# Altium schematic sheet pca20035_sheet5_power_supply.SchDoc: Thingy:91 Power Supply
size A3; Organization: Nordic Semiconductor; DocumentNumber: 5; SheetNumber: 5; SheetTotal: 6; CompanyName: Nordic Semiconductor; DocumentSize: A3
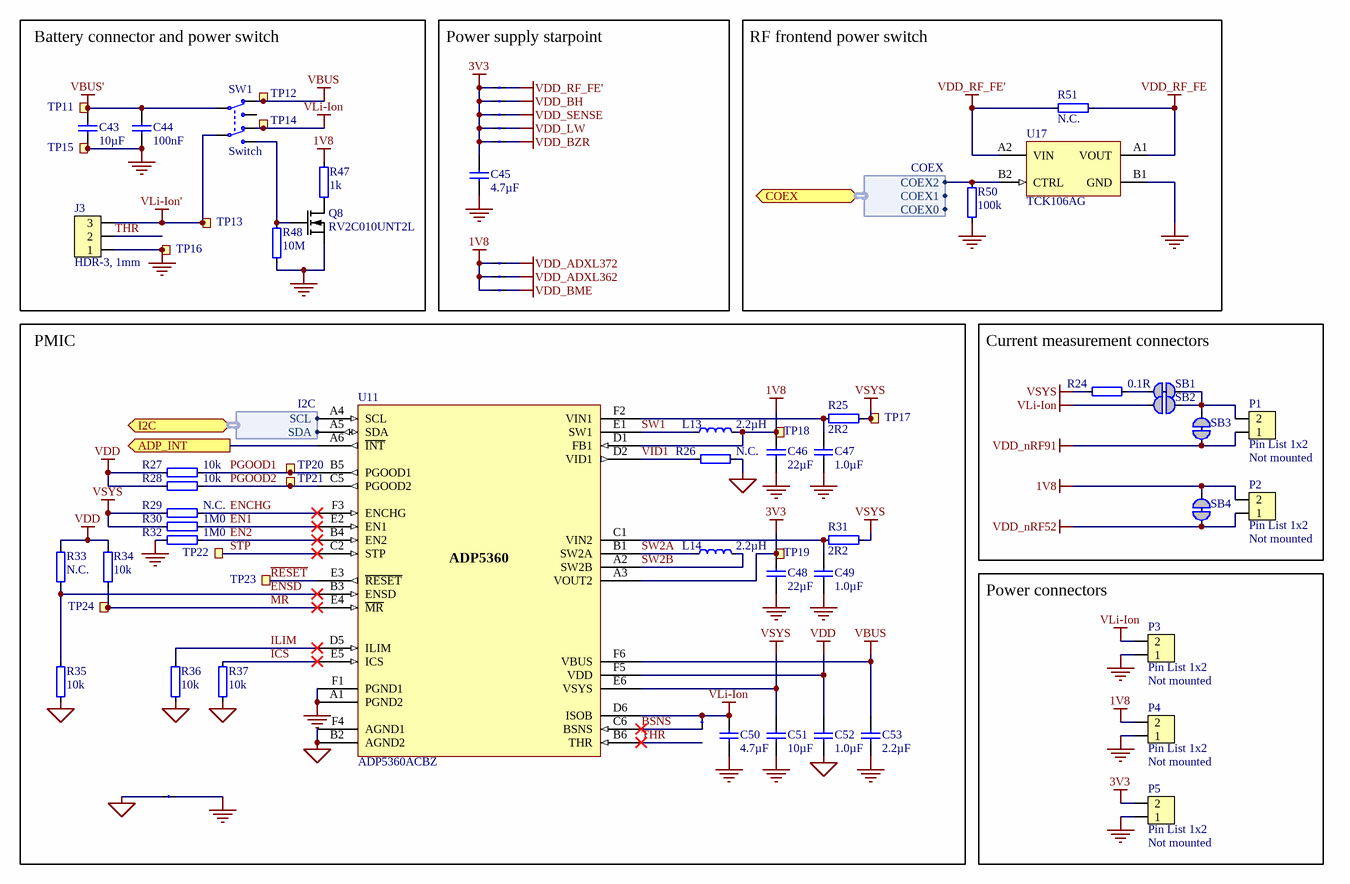
[diagram p0: pca20035_sheet5_power_supply.SchDoc]

## Parts
C43  10µF  [CAPC1608X06L]
C44  100nF  [CAPC0603X03L_C]
C45  4.7µF  [CAPC1608X06L]
C46  22µF  [CAPC1608X06L]
C47  1.0µF  [CAPC1005X04L]
C48  22µF  [CAPC1608X06L]
C49  1.0µF  [CAPC1608X06L]
C50  4.7µF  [CAPC1608X06L]
C51  10µF  [CAPC1608X06L]
C52  1.0µF  [CAPC1005X04L]
C53  2.2µF  [CAPC1608X06L]
J3  HDR-3, 1mm  [SM03B-SRSS-TB]
L13  2.2µH  [INDC2016X18N]
L14  2.2µH  [INDC2016X18N]
P1  Pin List 1x2  Assembly: Not mounted  [LIST_1x2-NC]
P2  Pin List 1x2  Assembly: Not mounted  [LIST_1x2-NC]
P3  Pin List 1x2  Assembly: Not mounted  [LIST_1x2-NC]
P4  Pin List 1x2  Assembly: Not mounted  [LIST_1x2-NC]
P5  Pin List 1x2  Assembly: Not mounted  [LIST_1x2-NC]
Q8  RV2C010UNT2L  [DFN65P100X40-3L]
R24  0.1R  [RESC1005X04L]
R25  2R2  [RESC1005X04L]
R26  N.C.  [RESC0603X03L_C_NC]
R27  10k  [RESC0603X03L_C]
R28  10k  [RESC0603X03L_C]
R29  N.C.  [RESC0603X03L_C_NC]
R30  1M0  [RESC0603X03L_C]
R31  2R2  [RESC1005X04L]
R32  1M0  [RESC0603X03L_C]
R33  N.C.  [RESC0603X03L_C_NC]
R34  10k  [RESC0603X03L_C]
R35  10k  [RESC0603X03L_C]
R36  10k  [RESC0603X03L_C]
R37  10k  [RESC0603X03L_C]
R47  1k  [RESC0603X03L_C]
R48  10M  [RESC0603X03L_C]
R50  100k  [RESC0603X03L_C]
R51  N.C.  [RESC0603X03L_C_NC]
SB1  Solderbridge  [Solderbridge_Shorted]  (value not drawn)  (net tie, no BOM)
SB2  Solderbridge  [Solderbridge]  (value not drawn)  (no BOM)
SB3  Solderbridge  [Solderbridge_Shorted]  (value not drawn)  (net tie, no BOM)
SB4  Solderbridge  [Solderbridge_Shorted]  (value not drawn)  (net tie, no BOM)
ST1  N.A.  [2 PIN STARPOINT]  (value not drawn)  (net tie, no BOM)
ST2  N.A.  [2 PIN STARPOINT]  (value not drawn)  (net tie, no BOM)
ST3  N.A.  [2 PIN STARPOINT]  (value not drawn)  (net tie, no BOM)
ST4  N.A.  [2 PIN STARPOINT]  (value not drawn)  (net tie, no BOM)
ST5  N.A.  [2 PIN STARPOINT]  (value not drawn)  (net tie, no BOM)
ST7  N.A.  [2 PIN STARPOINT]  (value not drawn)  (net tie, no BOM)
ST8  N.A.  [2 PIN STARPOINT]  (value not drawn)  (net tie, no BOM)
ST9  N.A.  [2 PIN STARPOINT]  (value not drawn)  (net tie, no BOM)
ST10  N.A.  [2 PIN STARPOINT]  (value not drawn)  (net tie, no BOM)
ST11  N.A.  [2 PIN STARPOINT]  (value not drawn)  (net tie, no BOM)
SW1  Switch  [Switch-Slide-RA-J-Lead-DPDT-8.5x3.5mm]
TP11  Ø1.5mm,SMD  [TP_SMD_Ø1.5mm]  (value not drawn)  (no BOM)
TP12  Ø1.5mm,SMD  [TP_SMD_Ø1.5mm]  (value not drawn)  (no BOM)
TP13  Ø1.5mm,SMD  [TP_SMD_Ø1.5mm]  (value not drawn)  (no BOM)
TP14  Ø1.5mm,SMD  [TP_SMD_Ø1.5mm]  (value not drawn)  (no BOM)
TP15  Ø1.5mm,SMD  [TP_SMD_Ø1.5mm]  (value not drawn)  (no BOM)
TP16  Ø1.5mm,SMD  [TP_SMD_Ø1.5mm]  (value not drawn)  (no BOM)
TP17  Ø1.5mm,SMD  [TP_SMD_Ø1.5mm]  (value not drawn)  (no BOM)
TP18  Ø1.5mm,SMD  [TP_SMD_Ø1.5mm]  (value not drawn)  (no BOM)
TP19  Ø1.5mm,SMD  [TP_SMD_Ø1.5mm]  (value not drawn)  (no BOM)
TP20  Ø1.5mm,SMD  [TP_SMD_Ø1.5mm]  (value not drawn)  (no BOM)
TP21  Ø1.5mm,SMD  [TP_SMD_Ø1.5mm]  (value not drawn)  (no BOM)
TP22  Ø1.0mm,SMD  [TP_SMD_Ø1.0mm]  (value not drawn)  (no BOM)
TP23  Ø1.0mm,SMD  [TP_SMD_Ø1.0mm]  (value not drawn)  (no BOM)
TP24  Ø1.0mm,SMD  [TP_SMD_Ø1.0mm]  (value not drawn)  (no BOM)
U11  ADP5360ACBZ  [BGA32C40P6X6_238X238X56]
U17  TCK106AG  [BGA4C40P2X2_76X76X62]

## Blocks framed on the sheet
Battery connector and power switch: C43 C44 J3 Q8 R47 R48 SW1 TP11-TP16
Power supply starpoint: C45 ST1-ST5 ST7-ST9
RF frontend power switch: R50 R51 U17
PMIC: C46-C53 L13 L14 R25-R37 ST10 ST11 TP17-TP24 U11
Current measurement connectors: P1 P2 R24 SB1-SB4
Power connectors: P3-P5

## Ports
ADP_INT (out), COEX (bidir, harness COEX), I2C (bidir, harness I2C)

## Harnesses
I2C: SDA, SCL
COEX: COEX2, COEX1, COEX0

## Nets
1V8: C46.2 L13.2 P2.2 P4.2 R47.1 SB4.2 ST7.1 ST8.1 ST9.1 TP18.1 U11.D1(FB1)
3V3: C45.2 C48.2 P5.2 ST1.1 ST2.1 ST3.1 ST4.1 ST5.1 TP19.1 U11.A3(VOUT2)
AGND: C52.1 R26.2 R35.1 R36.2 R37.2 ST11.1 U11.B2(AGND2) U11.F4(AGND1)
GND: C43.2 C44.2 C45.1 C46.1 C47.1 C48.1 C49.1 C50.1 C51.1 C53.1 J3.1 P3.1 P4.1 P5.1 Q8.2(S) R32.1 R48.2 R50.1 ST11.2 TP15.1 TP16.1 U11.A1(PGND2) U11.F1(PGND1) U17.B1(GND)
VBUS: C53.2 SW1.3(N.C-1) TP12.1 U11.F6(VBUS)
VBUS': C43.1 C44.1 SW1.2(COM-1) TP11.1
VDD: C52.2 R27.1 R28.1 R33.2 R34.1 U11.F5(VDD)
VDD_ADXL362: ST8.2
VDD_ADXL372: ST7.2
VDD_BH: ST2.2
VDD_BME: ST9.2
VDD_BZR: ST5.2
VDD_LW: ST4.2
VDD_nRF52: P2.1 SB4.1
VDD_nRF91: P1.1 SB3.1
VDD_RF_FE: R51.1 U17.A1(VOUT)
VDD_RF_FE': R51.2 ST1.2 U17.A2(VIN)
VDD_SENSE: ST3.2
VLi-Ion: C50.2 P3.2 SB2.2 ST10.2 SW1.6(N.C-2) TP14.1 U11.D6(ISOB)
VLi-Ion': J3.3 SW1.5(COM-2) TP13.1
VSYS: C51.2 R24.2 R25.2 R29.1 R30.1 R31.2 TP17.1 U11.E6(VSYS)
ADP_INT: U11.A6(~{INT}) ; port ADP_INT
BSNS: ST10.1 U11.C6(BSNS)
EN1: R30.2 U11.E2(EN1)
EN2: R32.2 U11.B4(EN2)
ENCHG: R29.2 U11.F3(ENCHG)
ENSD: R33.1 R35.2 U11.B3(ENSD)
ICS: R37.1 U11.E5(ICS)
ILIM: R36.1 U11.D5(ILIM)
~{MR}: R34.2 TP24.1 U11.E4(~{MR})
PGOOD1: R27.2 TP20.1 U11.B5(PGOOD1)
PGOOD2: R28.2 TP21.1 U11.C5(PGOOD2)
~{RESET}: TP23.1 U11.E3(~{RESET})
STP: TP22.1 U11.C2(STP)
SW1: L13.1 U11.E1(SW1)
SW2A: L14.1 U11.B1(SW2A)
SW2B: L14.2 U11.A2(SW2B)
THR: J3.2 U11.B6(THR)
VID1: R26.1 U11.D2(VID1)
NetC47_2: C47.2 R25.1 U11.F2(VIN1)
NetC49_2: C49.2 R31.1 U11.C1(VIN2)
NetP1_2: P1.2 SB1.1 SB2.1 SB3.2
NetQ8_1: Q8.1(G) R48.1 SW1.4(N.O-2)
NetQ8_3: Q8.3(D) R47.2
NetR24_1: R24.1 SB1.2
NetR50_2: R50.2 U17.B2(CTRL) ; port COEX.COEX2
NetU11_A4: U11.A4(SCL) ; port I2C.SCL
NetU11_A5: U11.A5(SDA) ; port I2C.SDA

Not connected (* = marked no-connect by the designer): SW1 1(N.O-1)

## Notes on the sheet
- Size
- Date:
- A3
- Project Number
- Sheet         of
- Revision
- File:
- Drawn By:
- (in symbol ADP5360ACBZ) ADP5360

## Library data of the parts
C43 C51 = C0603-10µ: Capacitor, X5R, ±20%; Manufacturer: N.A.; Part number IPS: 00000007785; Note: 6.3V; Artikkelnr Noca: 20039234; Pad Count: 2; Part Number: C0603-10µ; Manufacturer Part Number: N.A.; LatestRevisionDate: 2011-01-17; Published: 2011-01-17; Value: 10µF; Footprint Doc: 0603; ComponentLink1URL: N.A.; ComponentLink1Description: Datasheet; ComponentLink2URL: N.A.; ComponentLink2Description: Supplier link; HelpURL: N.A.; Supplier 1: N.A.; Supplier Part Number 1: N.A.; Supplier 2: N.A.; Supplier Part Number 2: N.A.; Component Class: Capacitors; PartId: 100200275
C44 = C0201-100n: Capacitor, X5R, ±10%; Manufacturer: N.A.; Part number IPS: 00000001248, 00000002505; Note: 16V; Pad Count: 2; Part Number: C0201-100n; Manufacturer Part Number: N.A.; LatestRevisionDate: 2017-11-09; Published: 2014-11-13; Value: 100nF; Artikkelnr Noca: N.A.; Footprint Doc: 0201; ComponentLink1URL: N.A.; ComponentLink1Description: Datasheet; ComponentLink2URL: N.A.; ComponentLink2Description: Supplier link; HelpURL: N.A.; Supplier 1: N.A.; Supplier Part Number 1: N.A.; Supplier 2: N.A.; Supplier Part Number 2: N.A.; Component Class: Capacitors; PartId: 100200078
C45 C50 = C0603-4µ7: Capacitor, X5R, ±10%; Manufacturer: N.A.; Part number IPS: 00000007783; Note: 6.3V; Artikkelnr Noca: 20069060; Pad Count: 2; Part Number: C0603-4µ7; Manufacturer Part Number: N.A.; Footprint Doc: 0603; LatestRevisionDate: 2009-11-23; Published: 2009-05-08; Value: 4.7µF; ComponentLink1URL: N.A.; ComponentLink1Description: Datasheet; ComponentLink2URL: N.A.; ComponentLink2Description: Supplier link; HelpURL: N.A.; Supplier 1: N.A.; Supplier Part Number 1: N.A.; Supplier 2: N.A.; Supplier Part Number 2: N.A.; Component Class: Capacitors; PartId: 100200274
C46 C48 = C0603-22µ-6.3V: Capacitor, X5R, ±20%, 6.3V; Manufacturer: Samsung Electro-Mechanics America; Manufacturer Part Number: CL10A226MQ8NRNC; Part number IPS: 00000007787; Artikkelnr Noca: N.A.; Pad Count: 2; Part Number: C0603-22µ-6.3V; Footprint Doc: 0603; LatestRevisionDate: 2015-04-10; Published: 2015-04-10; Value: 22µF; Note: 6.3V; ComponentLink1URL: N.A.; ComponentLink1Description: Datasheet; ComponentLink2URL: N.A.; ComponentLink2Description: Supplier link; HelpURL: http://www.samsungsem.com/kr/front/downloadcms.do?path=/kr/support/product-search/mlcc/__icsFiles/afieldfile/2014/11/05&fileName=S_CL10A226MQ8NRNC.pdf; Supplier 1: Digi-Key; Supplier Part Number 1: 1276-1193-1-ND; Supplier 2: N.A.; Supplier Part Number 2: N.A.; Component Class: Capacitors; PartId: 100200363
C47 C52 = C0402-1µ0: Capacitor, X5R, ±5%, 6.3V; Manufacturer: N.A.; Part number IPS: 00000007786, 00000003457; Artikkelnr Noca: 20039235; Pad Count: 2; Part Number: C0402-1µ0; Manufacturer Part Number: N.A.; Footprint Doc: 0402; LatestRevisionDate: 2016-08-22; Published: 2009-05-08; Value: 1.0µF; Note: 6.3V; ComponentLink1URL: N.A.; ComponentLink1Description: Datasheet; ComponentLink2URL: N.A.; ComponentLink2Description: Supplier link; HelpURL: N.A.; Supplier 1: Digi-Key; Supplier Part Number 1: 1276-1444-1-ND; Supplier 2: N.A.; Supplier Part Number 2: N.A.; Component Class: Capacitors; PartId: 100200190
C49 = C0603-1µ0: Capacitor, X7R, ±10%; Manufacturer: N.A.; Part number IPS: 00000000616; Note: 16V; Artikkelnr Noca: 20039282; Pad Count: 2; Part Number: C0603-1µ0; Manufacturer Part Number: N.A.; Footprint Doc: 0603; LatestRevisionDate: 2013-06-05; Published: 2009-05-08; Value: 1.0µF; ComponentLink1URL: N.A.; ComponentLink1Description: Datasheet; ComponentLink2URL: N.A.; ComponentLink2Description: Supplier link; HelpURL: N.A.; Supplier 1: N.A.; Supplier Part Number 1: N.A.; Supplier 2: N.A.; Supplier Part Number 2: N.A.; Component Class: Capacitors; PartId: 100200271
C53 = C0603-2µ2-10V: Capacitor, X7R, ±10%, 10V; Manufacturer: Samsung Electro-Mechanics America; Manufacturer Part Number: CL10B225KP8NNNC; Part number IPS: 00000001781; Artikkelnr Noca: 20030083; Pad Count: 2; Part Number: C0603-2µ2-10V; Footprint Doc: 0603; LatestRevisionDate: 2016-10-10; Published: 2016-10-10; Value: 2.2µF; Note: 10V; ComponentLink1URL: N.A.; ComponentLink1Description: Datasheet; ComponentLink2URL: N.A.; ComponentLink2Description: Supplier link; HelpURL: http://www.samsungsem.com/kr/front/downloadcms.do?path=/kr/support/product-search/mlcc/__icsFiles/afieldfile/2014/11/05&fileName=C_CL10B225KP8NNNC.pdf; Supplier 1: Digi-Key; Supplier Part Number 1: 1276-1134-1-ND; Supplier 2: N.A.; Supplier Part Number 2: N.A.; Component Class: Capacitors; PartId: 100200393
J3 = SM03B-SRSS-TB: 1.0mm pitch connector side entry SMD; Manufacturer: JST Sales America Inc.; Manufacturer Part Number: SM03B-SRSS-TB(LF)(SN); Part number IPS: 00000001785; Note: JST, Header; Artikkelnr Noca: N.A.; Pad Count: 3; Part Number: SM03B-SRSS-TB; Footprint Doc: SM03B-SRSS-TB; LatestRevisionDate: 2017-10-09; Published: 2017-10-09; Value: HDR-3, 1mm; ComponentLink1URL: N.A.; ComponentLink1Description: Datasheet; ComponentLink2URL: N.A.; ComponentLink2Description: Supplier link; HelpURL: http://www.jst-mfg.com/product/pdf/eng/eSH.pdf; Supplier 1: Cabcon; Supplier Part Number 1: SM03B-SRSS-TB(LF)(SN); Supplier 2: Digi-Key; Supplier Part Number 2: 455-1803-1-ND; Component Class: Connectors; PartId: 100500605
L13 L14 = L0806-2µ2-1.2A-110mOhm: Shielded Multilayer Inductor, 1.2A, ±20%, 110mOhm, Q=10 @ 1MHz; Manufacturer: Wurth Elektronik; Manufacturer Part Number: 74479776222A; Part number IPS: 80000001820; Note: N.A.; Pad Count: 2; Part Number: L0806-2µ2-1.2A-110mOhm; Footprint Doc: 0806; LatestRevisionDate: 2020-01-07; Published: 2019-01-11; Value: 2.2µH; Artikkelnr Noca: N.A.; ComponentLink1Description: Datasheet; ComponentLink2Description: Supplier link; ComponentLink1URL: https://katalog.we-online.de/pbs/datasheet/74479776222.pdf; ComponentLink2URL: N.A.; HelpURL: https://media.digikey.com/PDF/Data%20Sheets/Wurth%20Electronics%20PDFs/Passive_Components_Products_Catalog.pdf; Supplier 1: Digi-Key; Supplier Part Number 1: 732-2954-1-ND; Supplier 2: Mouser; Supplier Part Number 2: 710-74479776222; Component Class: Inductors; PartId: 100300125
P1-P5 = Pin List 1x2, N.C.: Pin List 1x2, 2.54mm (100mil); Manufacturer: N.A.; Pad Count: 2; Part Number: Pin List 1x2, N.C.; Manufacturer Part Number: N.A.; Footprint Doc: LIST_1x2; LatestRevisionDate: 2017-02-02; Published: 2017-01-30; Value: Pin List 1x2; Note: N.A.; Artikkelnr Noca: N.A.; Part number IPS: N.A.; ComponentLink1URL: N.A.; ComponentLink1Description: Datasheet; ComponentLink2URL: N.A.; ComponentLink2Description: Supplier link; HelpURL: N.A.; Supplier 1: N.A.; Supplier Part Number 1: N.A.; Supplier 2: N.A.; Supplier Part Number 2: N.A.; Component Class: Connectors; PartId: 100500298
Q8 = RV2C010UNT2L: N-Channel MOSFET, 20V, 1A, 470mOhm, 400mW; Manufacturer: Rohm Semiconductor; Part number IPS: 00000009976; Note: N.A.; Artikkelnr Noca: 35010020; Pad Count: 3; Part Number: RV2C010UNT2L; Manufacturer Part Number: RV2C010UNT2L; Footprint Doc: DFN-3; LatestRevisionDate: 2016-08-09; Published: 2016-08-09; Value: RV2C010UNT2L; ComponentLink1URL: N.A.; ComponentLink1Description: Datasheet; ComponentLink2URL: N.A.; ComponentLink2Description: Supplier link; HelpURL: http://rohmfs.rohm.com/en/products/databook/datasheet/discrete/transistor/mosfet/rv2c010unt2l-e.pdf; Supplier 1: Digi-Key; Supplier Part Number 1: RV2C010UNT2LCT-ND; Supplier 2: Mouser; Supplier Part Number 2: 755-RV2C010UNT2L; Component Class: Semiconductors; PartId: 101300132
R24 = R0402-0R1: Resistor, ±1%, 0.063W; Manufacturer: N.A.; Part number IPS: 00000001795; Note: Chip Res 1%; Pad Count: 2; Part Number: R0402-0R1; Manufacturer Part Number: N.A.; ComponentLink1URL: N.A.; ComponentLink1Description: Datasheet; ComponentLink2URL: N.A.; ComponentLink2Description: Supplier link; HelpURL: N.A.; Footprint Doc: 0402; LatestRevisionDate: 2012-06-22; Published: 2012-06-22; Value: 0.1R; Supplier 1: Digi-Key; Supplier Part Number 1: 311-.10PDKR-ND; Supplier 2: N.A.; Supplier Part Number 2: N.A.; Artikkelnr Noca: N.A.; Component Class: Resistors; PartId: 100100111
R25 R31 = R0402-2R2: Resistor, ±1%, 0.063W; Manufacturer: N.A.; Part number IPS: 00000001796; Note: Chip Res 1%; Artikkelnr Noca: 27049009; Pad Count: 2; Part Number: R0402-2R2; Manufacturer Part Number: N.A.; ComponentLink1URL: N.A.; ComponentLink1Description: Datasheet; ComponentLink2URL: N.A.; ComponentLink2Description: Supplier link; HelpURL: N.A.; Footprint Doc: 0402; LatestRevisionDate: 2012-06-22; Published: 2012-06-22; Value: 2R2; Supplier 1: N.A.; Supplier Part Number 1: N.A.; Supplier 2: N.A.; Supplier Part Number 2: N.A.; Component Class: Resistors; PartId: 100100116
R26 R29 R33 = R0201-N.C.: Not mounted; Manufacturer: N.A.; Note: Chip Res; Assembly: Not mounted; Pad Count: 2; Part Number: R0201-N.C.; Manufacturer Part Number: N.A.; LatestRevisionDate: 2014-11-13; Published: 2014-11-13; Value: N.C.; Artikkelnr Noca: N.A.; Footprint Doc: 0201; Part number IPS: N.A.; ComponentLink1URL: N.A.; ComponentLink1Description: Datasheet; ComponentLink2URL: N.A.; ComponentLink2Description: Supplier link; HelpURL: N.A.; Supplier 1: N.A.; Supplier Part Number 1: N.A.; Supplier 2: N.A.; Supplier Part Number 2: N.A.; Component Class: Resistors; PartId: 100100107
R27 R28 R34-R37 = R0201-10k: Resistor, ±1%, 0.05W; Manufacturer: N.A.; Part number IPS: 00000001255; Note: Chip Res 1%; Pad Count: 2; Part Number: R0201-10k; Manufacturer Part Number: N.A.; LatestRevisionDate: 2014-11-13; Published: 2014-11-13; Value: 10k; Artikkelnr Noca: N.A.; Footprint Doc: 0201; ComponentLink1URL: N.A.; ComponentLink1Description: Datasheet; ComponentLink2URL: N.A.; ComponentLink2Description: Supplier link; HelpURL: N.A.; Supplier 1: N.A.; Supplier Part Number 1: N.A.; Supplier 2: N.A.; Supplier Part Number 2: N.A.; Component Class: Resistors; PartId: 100100065
R30 R32 = R0201-1M0: Resistor, ±1%, 0.05W; Manufacturer: N.A.; Part number IPS: 00000001418; Note: Chip Res 1%; Pad Count: 2; Part Number: R0201-1M0; Manufacturer Part Number: N.A.; LatestRevisionDate: 2014-11-13; Published: 2014-11-13; Value: 1M0; Artikkelnr Noca: N.A.; Footprint Doc: 0201; ComponentLink1URL: N.A.; ComponentLink1Description: Datasheet; ComponentLink2URL: N.A.; ComponentLink2Description: Supplier link; HelpURL: N.A.; Supplier 1: N.A.; Supplier Part Number 1: N.A.; Supplier 2: N.A.; Supplier Part Number 2: N.A.; Component Class: Resistors; PartId: 100100093
R47 = R0201-1k0: Resistor, ±1%, 0.05W; Manufacturer: N.A.; Part number IPS: 00000005786; Note: Chip Res 1%; Pad Count: 2; Part Number: R0201-1k0; Manufacturer Part Number: N.A.; LatestRevisionDate: 2014-11-13; Published: 2014-11-13; Value: 1k; Artikkelnr Noca: N.A.; Footprint Doc: 0201; ComponentLink1URL: N.A.; ComponentLink1Description: Datasheet; ComponentLink2URL: N.A.; ComponentLink2Description: Supplier link; HelpURL: N.A.; Supplier 1: N.A.; Supplier Part Number 1: N.A.; Supplier 2: N.A.; Supplier Part Number 2: N.A.; Component Class: Resistors; PartId: 100100043
R48 = R0201-10M: Resistor, ±1%, 0.05W; Manufacturer: N.A.; Part number IPS: 00000001426; Note: Chip Res 1%; Pad Count: 2; Part Number: R0201-10M; Manufacturer Part Number: N.A.; LatestRevisionDate: 2014-11-13; Published: 2014-11-13; Value: 10M; Artikkelnr Noca: N.A.; Footprint Doc: 0201; ComponentLink1URL: N.A.; ComponentLink1Description: Datasheet; ComponentLink2URL: N.A.; ComponentLink2Description: Supplier link; HelpURL: N.A.; Supplier 1: N.A.; Supplier Part Number 1: N.A.; Supplier 2: N.A.; Supplier Part Number 2: N.A.; Component Class: Resistors; PartId: 100100105
R50 = R0201-100k: Resistor, ±1%, 0.05W; Manufacturer: N.A.; Part number IPS: 00000001419; Note: Chip Res 1%; Pad Count: 2; Part Number: R0201-100k; Manufacturer Part Number: N.A.; ComponentLink1URL: N.A.; ComponentLink1Description: Datasheet; ComponentLink2URL: N.A.; ComponentLink2Description: Supplier link; HelpURL: N.A.; Footprint Doc: 0201; LatestRevisionDate: 2014-11-13; Published: 2014-11-13; Value: 100k; Artikkelnr Noca: N.A.; Supplier 1: N.A.; Supplier Part Number 1: N.A.; Supplier 2: N.A.; Supplier Part Number 2: N.A.; PartId: 100100080; Component Class: Resistors
R51 = R0201-N.C.: Not mounted; Manufacturer: N.A.; Assembly: Not mounted; Note: Chip Res; Pad Count: 2; Part Number: R0201-N.C.; Manufacturer Part Number: N.A.; ComponentLink1URL: N.A.; ComponentLink1Description: Datasheet; ComponentLink2URL: N.A.; ComponentLink2Description: Supplier link; HelpURL: N.A.; Footprint Doc: 0201; LatestRevisionDate: 2014-11-13; Published: 2014-11-13; Value: N.C.; Artikkelnr Noca: N.A.; Part number IPS: N.A.; Supplier 1: N.A.; Supplier Part Number 1: N.A.; Supplier 2: N.A.; Supplier Part Number 2: N.A.; PartId: 100100107; Component Class: Resistors
SB1 SB3 SB4 = Solderbridge Shorted: Shorted Solderbridge; Manufacturer: N.A.; Pad Count: 2; Part Number: Solderbridge Shorted; Manufacturer Part Number: N.A.; Footprint Doc: Solderbridge_Shorted; LatestRevisionDate: 2012-08-07; Published: 2012-08-07; Value: Solderbridge; Note: N.A.; Artikkelnr Noca: N.A.; Part number IPS: N.A.; ComponentLink1URL: N.A.; ComponentLink1Description: Datasheet; ComponentLink2URL: N.A.; ComponentLink2Description: Supplier link; HelpURL: N.A.; Supplier 1: N.A.; Supplier Part Number 1: N.A.; Supplier 2: N.A.; Supplier Part Number 2: N.A.; Component Class: Connectors; PartId: 100500459
SB2 = Solderbridge: Manufacturer: N.A.; Pad Count: 2; Part Number: Solderbridge; Manufacturer Part Number: N.A.; Footprint Doc: Solderbridge; LatestRevisionDate: 2009-12-14; Published: 2009-12-14; Value: Solderbridge; Note: N.A.; Artikkelnr Noca: N.A.; Part number IPS: N.A.; ComponentLink1URL: N.A.; ComponentLink1Description: Datasheet; ComponentLink2URL: N.A.; ComponentLink2Description: Supplier link; HelpURL: N.A.; Supplier 1: N.A.; Supplier Part Number 1: N.A.; Supplier 2: N.A.; Supplier Part Number 2: N.A.; Component Class: Connectors; PartId: 100500458
ST1-ST5 ST7-ST11 = 2 pin starpoint: Starpoint; Pad Count: 2; Part Number: 2 pin starpoint; Manufacturer: N.A.; Manufacturer Part Number: N.A.; ComponentLink1URL: N.A.; ComponentLink1Description: Datasheet; ComponentLink2URL: N.A.; ComponentLink2Description: Supplier link; HelpURL: N.A.; Footprint Doc: N.A.; LatestRevisionDate: 2017-08-31; Published: 2017-08-31; Value: N.A.; Note: N.A.; Supplier 1: N.A.; Supplier Part Number 1: N.A.; Supplier 2: N.A.; Supplier Part Number 2: N.A.; Artikkelnr Noca: N.A.; Part number IPS: N.A.; Component Class: Connectors; PartId: 100500603
SW1 = Switch-Slide-RA-J-Lead-DPDT-8.5x3.5mm_Copal: SMD slide Switch (ON-ON); Manufacturer: Copal Electronics Inc; Manufacturer Part Number: CL-SB-22A-11T; Part number IPS: 00000007811; Note: N.A.; Pad Count: 6; Part Number: Switch-Slide-RA-J-Lead-DPDT-8.5x3.5mm_Copal; Footprint Doc: Switch-Slide-RA-J-Lead-DPDT-8.5x3.5mm; LatestRevisionDate: 2017-02-01; Published: 2017-02-01; Value: Switch; Artikkelnr Noca: N.A.; ComponentLink1URL: N.A.; ComponentLink1Description: Datasheet; ComponentLink2URL: N.A.; ComponentLink2Description: Supplier link; HelpURL: http://www.nidec-copal-electronics.com/e/catalog/switch/cl-sb.pdf; Supplier 1: Digi-Key; Supplier Part Number 1: 563-1340-1-ND; Supplier 2: Avnet; Supplier Part Number 2: CL-SB-22A-11T; Component Class: Switches; PartId: 101500038
TP11-TP21 = TP_SMD_Ø1.5MM: 1.5mm circular SMD testpad; Manufacturer: Nordic Semiconductor; Manufacturer Part Number: N.A.; Pad Count: 1; Part Number: TP_SMD_Ø1.5MM; Footprint Doc: TP_SMD_Ø1.5mm; LatestRevisionDate: 2016-06-02; Published: 2016-06-02; Value: Ø1.5mm,SMD; Note: N.A.; Artikkelnr Noca: N.A.; Part number IPS: N.A.; ComponentLink1URL: N.A.; ComponentLink1Description: Datasheet; ComponentLink2URL: N.A.; ComponentLink2Description: Supplier link; HelpURL: N.A.; Supplier 1: N.A.; Supplier Part Number 1: N.A.; Supplier 2: N.A.; Supplier Part Number 2: N.A.; Component Class: Connectors; PartId: 100500477
TP22-TP24 = TP_SMD_Ø1.0MM: 1.0mm circular SMD testpad; Manufacturer: Nordic Semiconductor; Manufacturer Part Number: N.A.; Pad Count: 1; Part Number: TP_SMD_Ø1.0MM; Footprint Doc: TP_SMD_Ø1.0mm; LatestRevisionDate: 2013-06-11; Published: 2013-06-11; Value: Ø1.0mm,SMD; Note: N.A.; Artikkelnr Noca: N.A.; Part number IPS: N.A.; ComponentLink1URL: N.A.; ComponentLink1Description: Datasheet; ComponentLink2URL: N.A.; ComponentLink2Description: Supplier link; HelpURL: N.A.; Supplier 1: N.A.; Supplier Part Number 1: N.A.; Supplier 2: N.A.; Supplier Part Number 2: N.A.; Component Class: Connectors; PartId: 100500475
U11 = ADP5360ACBZ: Advanced Battery Management PMIC With Ultralow Iq Buck and Buck-Boost; Manufacturer: Analog Devices; Part number IPS: 80000001823; Note: N.A.; Pad Count: 32; Part Number: ADP5360ACBZ; Manufacturer Part Number: ADP5360ACBZ; ComponentLink1URL: \\hizz\pro\app9717\Datasheet\integated circuits\analog\ADP5360 PRC3 Datasheet_022017.pdf; ComponentLink1Description: Datasheet; ComponentLink2URL: N.A.; ComponentLink2Description: Supplier link; HelpURL: N.A.; Footprint Doc: WLCSP-32; LatestRevisionDate: 2018-09-18; Published: 2018-09-18; Value: ADP5360ACBZ; Supplier 1: N.A.; Supplier Part Number 1: N.A.; Supplier 2: N.A.; Supplier Part Number 2: N.A.; Artikkelnr Noca: N.A.; Component Class: Misc_ICs; PartId: 101900554
U17 = TCK106AG: 1.0 A Load Switch IC with Slew Rate Control Driver in Ultra Small Package; Manufacturer: Toshiba; Manufacturer Part Number: TCK106AG,LF; Part number IPS: 00000004390; Pad Count: 4; Note: N.A.; Part Number: TCK106AG; PartId: 101900575; Component Class: Misc_ICs; ComponentLink1URL: https://toshiba.semicon-storage.com/info/docget.jsp?did=30131&prodName=TCK106AG; ComponentLink1Description: Datasheet; ComponentLink2URL: N.A.; ComponentLink2Description: Supplier link; HelpURL: N.A.; Footprint Doc: WLCSP-4; LatestRevisionDate: 2019-03-01; Published: 2019-02-17; Value: TCK106AG; Supplier 1: Digi-Key; Supplier Part Number 1: TCK106AGLFTR-ND; Supplier 2: Mouser; Supplier Part Number 2: 757-TCK106AGLF; Artikkelnr Noca: N.A.